# Altium project UAVCAN_rooms-Prj.PrjPcb
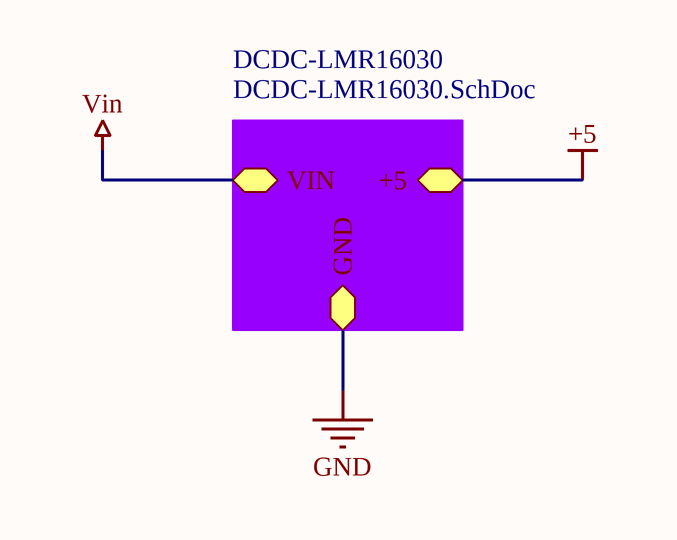
[diagram p0: UAVCAN_rooms-SchDoc.SchDoc]
Author: Ehsan Shaghaei; Version: 1.0
7 sheets, 92 parts. Net scope: hierarchical (ports join the sheet entries above them; power ports are global).
Board files: UAVCAN_rooms-PCBDoc.PcbDoc, DCDC-LMR16030-PCBDoc.PcbDoc
Sheets:
  UAVCAN_rooms-SchDoc.SchDoc
    DCDC-LMR16030 = DCDC-LMR16030.SchDoc
  ESP32_CAM.SchDoc
    DCDC-SPX3829m5 = DCDC-SPX3829m5.SchDoc
    DCDC-SPX3829m5 = DCDC-SPX3829m5.SchDoc
    DCDC-SPX3829m6 = DCDC-SPX3829m5.SchDoc
    CP2102_USB-UART = CP2102_USB-UART.SchDoc
    CAN_TJA1042-SchoDoc = CAN_TJA1042-SchoDoc.SchDoc
    DCDC-LMR16030 = DCDC-LMR16030.SchDoc
  PowerMonitor.SchDoc

## Sheet UAVCAN_rooms-SchDoc.SchDoc
size 431 x 279 mm; SheetNumber: 1; SheetTotal: 2

### Sub-sheets
DCDC-LMR16030 = DCDC-LMR16030.SchDoc: GND (bidir), VIN (bidir), +5 (bidir)

### Nets
Vin: sheet DCDC-LMR16030/VIN

### Notes on the sheet
- DWG. NO.
- REV.
- SHT.
- THIS DOCUMENT AND THE DATA DISCLOSED HEREIN OR HEREWITH IS THE PROPERTY OF ALTIUM LIMITED AND MAY BE FREELY DISTRIBUTED IN WHOLE. NO RIGHTS ARE RESERVED OR EXPRESS OR IMPLIED WARANTEE GIVEN.
- REVISION
- DESCRIPTION
- DATE
- APPROVED
- ENG:
- APPROVALS
- PROJECT
- DSN:
- CHK:
- REFERENCE DOCUMENTS
- PROJECT REVISION:
- TITLE
- DOCUMENT REVISION:
- DESIGN ITEM:
- BOM:
- FAB DWG:
- PCB DWG:
- ASSY DWG:
- SCALE:
- SIZE
- B
- CAGE CODE
- FILE NAME
- DWG NO.
- SHEET
- OF
- REV

## Sheet DCDC-LMR16030.SchDoc
size A3; Engineer: Ehsan Shaghaei; Revision: 9; SheetNumber: 3; SheetTotal: 7
Used 2 times, as channels DCDC-LMR16030, DCDC-LMR16030. Parts and nets are listed once, with the designators drawn on the sheet.
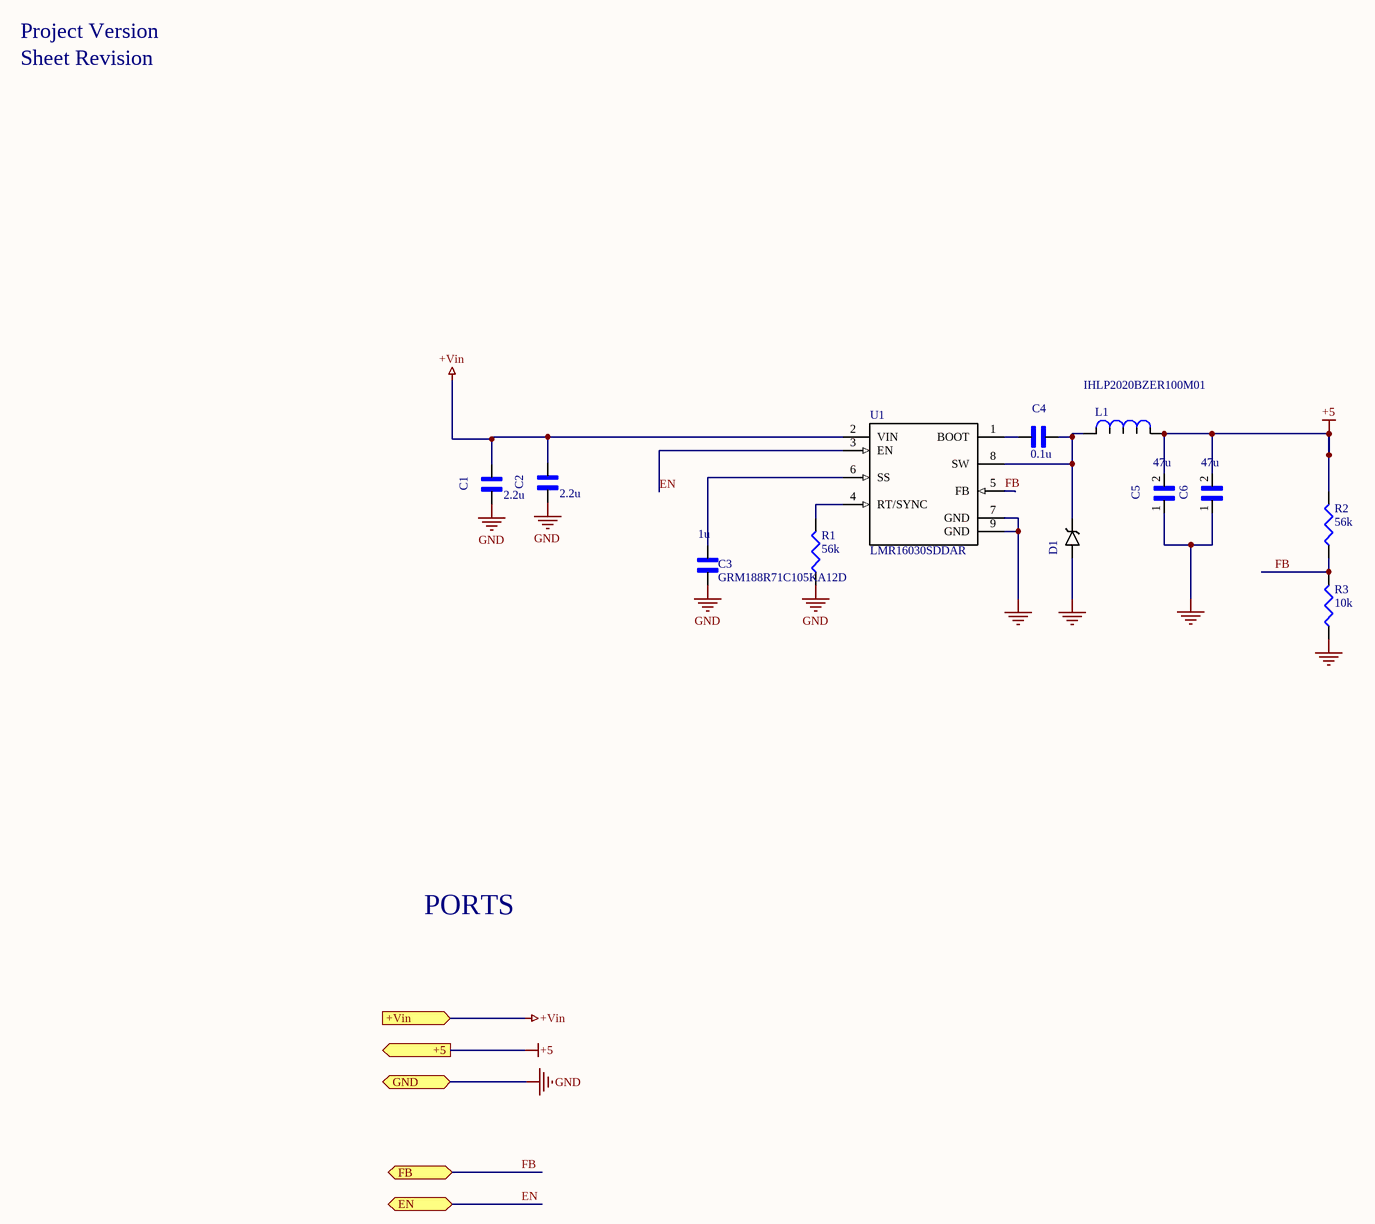
[diagram p1: DCDC-LMR16030.SchDoc]

### Parts
C1  value 2.2u  [*CAP3216X125N]  (hidden comment: GRM31CR71H225KA88L)
C2  value 2.2u  [*CAP3216X125N]  (hidden comment: GRM31CR71H225KA88L)
C3  GRM188R71C105KA12D  value 1u  [CAPC1608X90N]
C4  value 0.1u  [*CAPC1608X90]  (hidden comment: GX035C104MAT2-500)
C5  value 47u  [*CAPC3216X125N]  (hidden comment: GRM31CR61A476KE15L)
C6  value 47u  [*CAPC3216X125N]  (hidden comment: GRM31CR61A476KE15L)
D1  SK56  [*SMB_P6SMB62AT3G(Primary)]  (value not drawn)
L1  IHLP2020BZER100M01  [IHLP]
R1  value 56k  [J1-0603]  (hidden comment: Res3)
R2  value 56k  [J1-0603]  (hidden comment: Res3)
R3  value 10k  [J1-0603]  (hidden comment: RC0603FR-0710KL)
U1  LMR16030SDDAR  [*SOIC127P600X170-9N - duplicate]

### Ports
+5 (out), +Vin (in), EN (bidir), FB (bidir), GND (bidir)

### Nets
+5: C5.2 C6.2 L1.1 R2.2 ; port +5
+Vin: C1.1 C2.1 U1.2(VIN) ; port +Vin
GND: C1.2 C2.2 C3.1 C5.1 C6.1 D1.A R1.1 R3.1 U1.7(GND) U1.9(GND) ; port GND
EN: U1.3(EN) ; port EN
FB: R2.1 R3.2 U1.5(FB) ; port FB
NetC3_2: C3.2 U1.6(SS)
NetC4_1: C4.1 D1.C L1.2 U1.8(SW)
NetC4_2: C4.2 U1.1(BOOT)
NetR1_2: R1.2 U1.4(RT/SYNC)

### Channels
DCDC-LMR16030: ports +5=+5 +Vin=+Vin EN=EN_DCDC-LMR16030 FB=FB_DCDC-LMR16030 GND=GND
DCDC-LMR16030: designators end in _DCDC-LMR16030; ports +5=+5 +Vin=+Vin EN=EN_DCDC-LMR16030 FB=FB_DCDC-LMR16030 GND=GND

### Notes on the sheet
- Project Version
- Sheet Revision
- PORTS

### Library data of the parts
C1 C2 = GRM31CR71H225KA88L: 1206 2.2 uF 50 V В±10% Tolerance X7R SMT Multilayer Ceramic Capacitor; MF: Murata Electronics; Type: SMD; Package: 1206 Murata; SnapEDA_Link: https://www.snapeda.com/parts/GRM31CR71H225KA88L/Murata%20Electronics%20North%20America/view-part/?ref=snap; MP: GRM31CR71H225KA88L
C3 = GRM188R71C105KA12D: SMD Capacitor X7R(EIA) with Capacitance: 1.0uF Tol. 10%. Rated Voltage: 16Vdc; MF: Murata Electronics; Pacage Metric: 1608; MP: GRM188R71C105KA12D; SnapEDA_Link: https://www.snapeda.com/parts/GRM188R71C105KA12D/Murata%20Electronics%20North%20America/view-part/228340/?ref=snap; Package: 0603; ChipDip_Link: https://www.chipdip.ru/product/grm188r71c105ka12d; HelpURL: https://static.chipdip.ru/lib/428/DOC005428493.pdf; Type: SMD
C4 = GX035C104MAT2-500: Cap Thin Film 0.1uf 50v 0603; MF: AVX; MP: GX035C104MAT2-500 or CL10B104JB8NNNC; Pacage Metric: 1608; Type: SMD; Package: 0603 AVX; SnapEDA_Link: https://www.snapeda.com/parts/GX035C104MAT2-500/AVX/view-part/?ref=snap
C5 C6 = GRM31CR61A476KE15L: Multilayer Ceramic Capacitor, GRM Series, 47 - F, - 10%, X5R, 10 V, 1206 [3216 Metric]; MF: Murata Electronics; Type: SMD; Package: 1206 Murata Electronics; MP: GRM31CR61A476KE15L; SnapEDA_Link: https://www.snapeda.com/parts/GRM31CR61A476KE15L/Murata%20Electronics%20North%20America/view-part/?ref=snap
D1 = SK56: Диод Шоттки 5А 60В [SMB / DO-214AA]; MF: Littelfuse Inc.; Type: SMD; MP: SK56; Package: DO-214 Littelfuse; SnapEDA_Link: https://www.snapeda.com/parts/P6SMB62AT3G/Littelfuse%20Inc./view-part/?ref=snap; Value: *; ChipDip_Link: https://www.chipdip.ru/product/sk56
L1 = IHLP2020BZER100M01: 10ÂµH Shielded Molded Inductor 2.3A 199mOhm Max Nonstandard; MF: Vishay Dale; Type: SMD; SnapEDA_Link: https://www.snapeda.com/parts/IHLP2020BZER100M01/Vishay%20Dale/view-part/44808/?ref=snap; MP: IHLP2020BZER100M01; Value: *; Package: Nonstandard Vishay; HelpURL: http://www.vishay.com/docs/34253/ihlp-2020bz-01.pdf; ChipDip_Link: https://www.chipdip.ru/product/ihlp2020bzer100m11-inductor-ihlp-smd-2020-10
R1 R2 = Res3: Resistor; Pacage Metric: 1608; MP: RC0603FR-0756KL; ChipDip_Link: https://www.chipdip.ru/product0/9000079754; HelpURL: https://www.chipdip.ru/product0/9000079754; Package: R0603; Type: SMD
R3 = RC0603FR-0710KL: 10 kOhms 1 0.1 W 1 10 W Chip Resistor 0603 1608 Metric Thick Film; Pacage Metric: 1608; MF: Yageo or NXP; MP: 10K 1% 0603; ChipDip_Link: https://www.chipdip.ru/product0/9000079736; HelpURL: https://www.chipdip.ru/product0/9000079736; Package: R0603; Type: SMD; SnapEDA_Link: https://www.snapeda.com/parts/RC0603FR-0710KL/Yageo/view-part/?ref=dk&t=RC0603FR-0710KL&con_ref=None
U1 = LMR16030SDDAR: LMR16030SDDAR, Conv DC-DC 4.3V to 60V Step Down Single-Out 1V to 50V 3A Automotive 8-Pin HSOP EP T/R; MF: Texas Instruments; SnapEDA_Link: https://www.snapeda.com/parts/TPS54560DDA/Texas%20Instruments/view-part/?ref=snap; MP: LMR16030SDDAR; Package: PowerSOIC-8 Texas Instruments; Value: *; Type: SMD; ChipDip_Link: https://www.chipdip.ru/product1/8003448566; HelpURL: https://www.ti.com/lit/ds/symlink/lmr16030.pdf

## Sheet ESP32_CAM.SchDoc
size B; ApprovedBy: Kosnstantine; Engineer: Ehsan Shaghaei; SheetNumber: 2; SheetTotal: 7
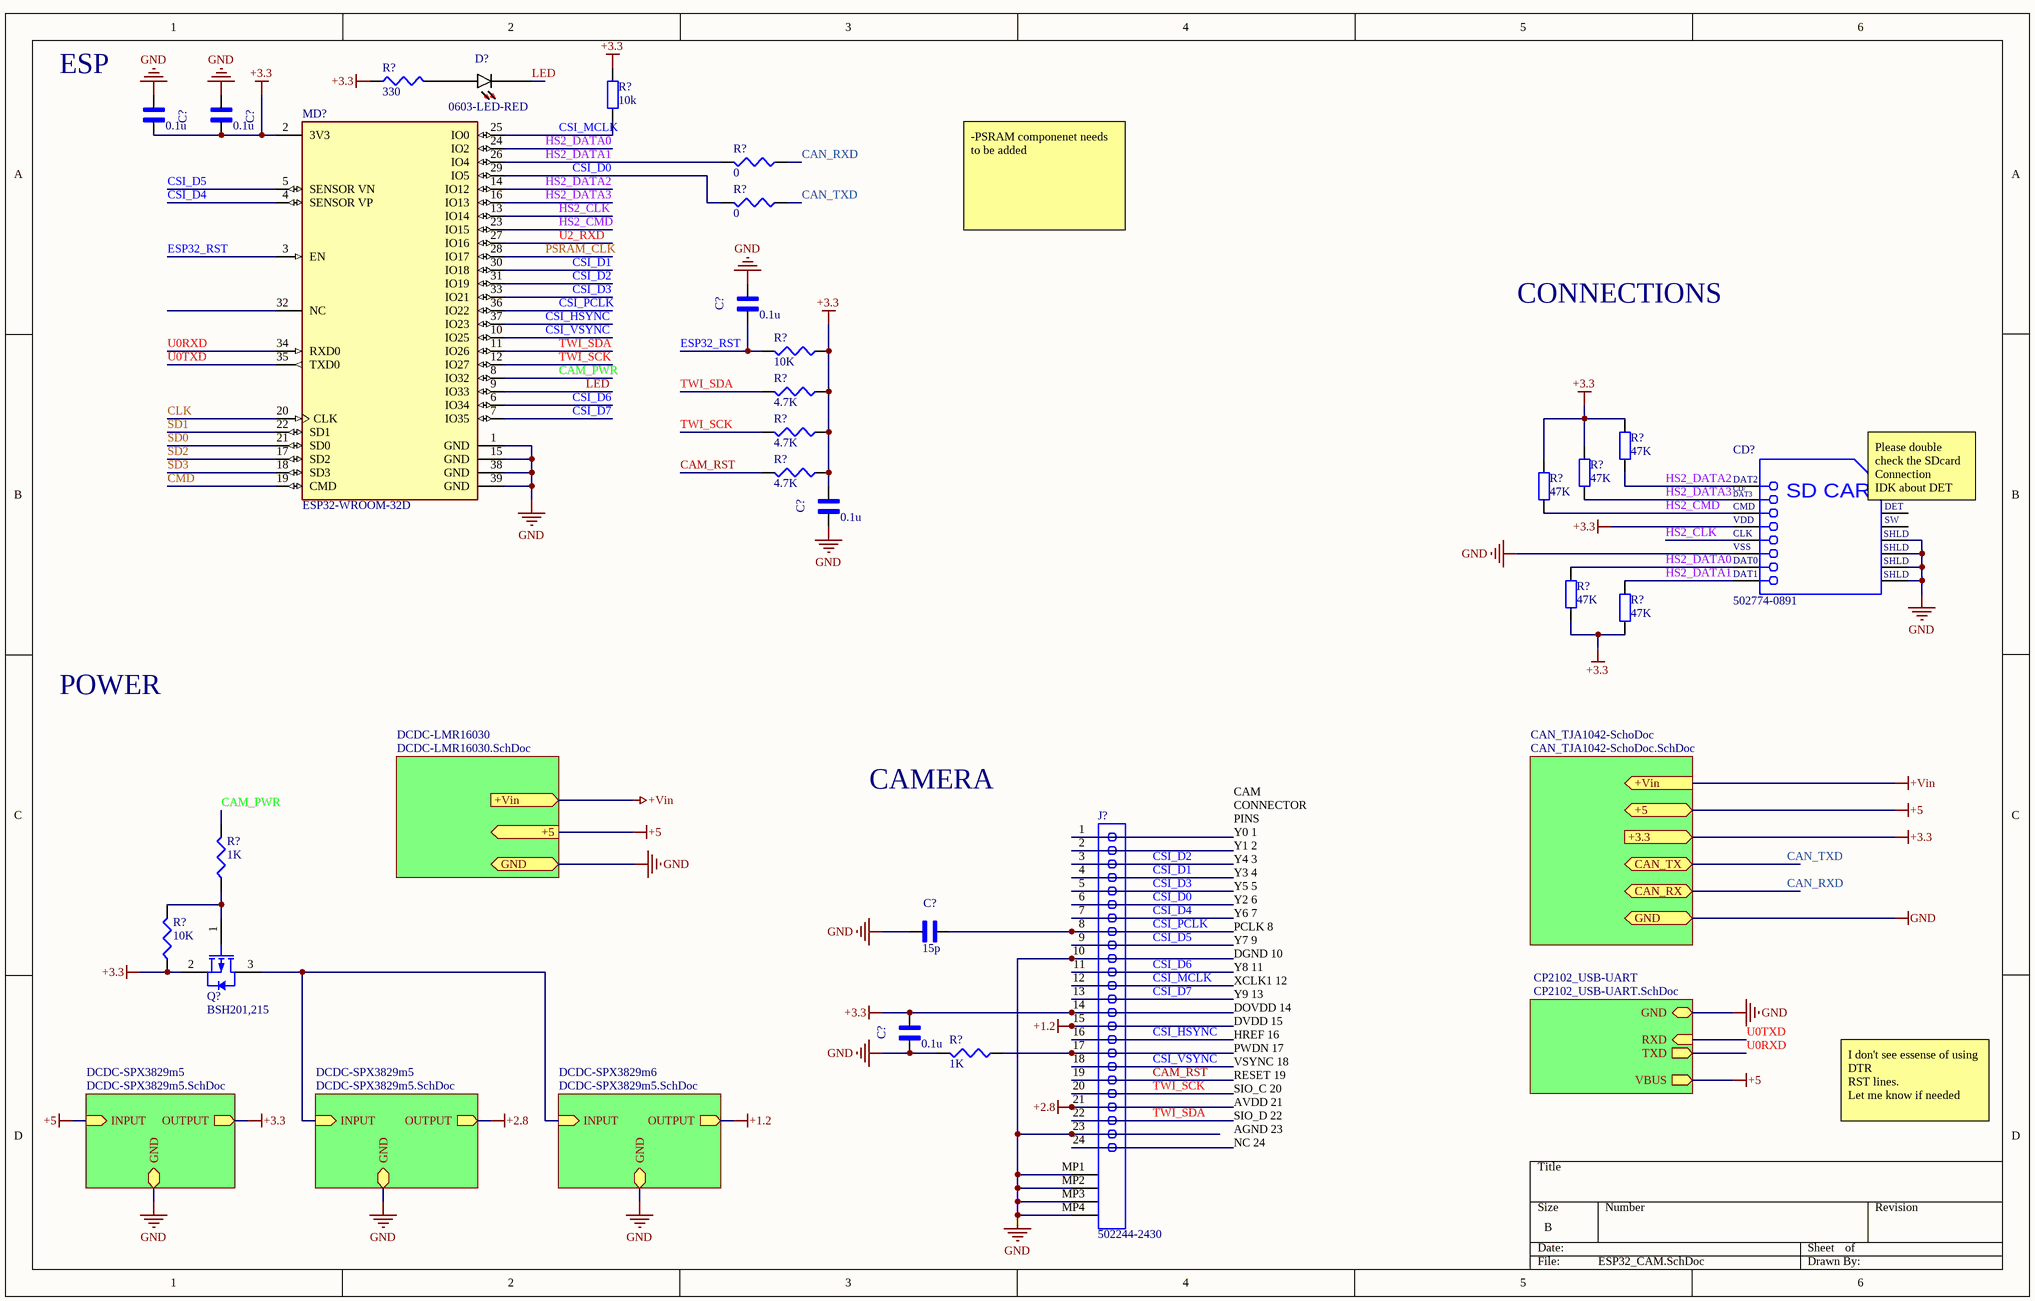
[diagram p2: ESP32_CAM.SchDoc]

### Parts
(Parts that share a designator on the sheet are numbered #1, #2 ... from top to bottom, then left to right.)
C?#1  value 0.1u  [*CAPC1608X90]  (hidden comment: GX035C104MAT2-500)
C?#2  value 0.1u  [*CAPC1608X90]  (hidden comment: GX035C104MAT2-500)
C?#3  value 0.1u  [*CAPC1608X90]  (hidden comment: GX035C104MAT2-500)
C?#4  value 0.1u  [*CAPC1608X90]  (hidden comment: GX035C104MAT2-500)
C?#5  value 15p  [*CAPC1608X90]  (hidden comment: GX035C104MAT2-500)
C?#6  value 0.1u  [*CAPC1608X90]  (hidden comment: GX035C104MAT2-500)
CD?  502774-0891  [MOLX-502774-0891_V]
D?#1  0603-LED-RED  [*LEDM1608X80_LTE-C1906R-14(Primary)]
J?#1  502244-2430  [MOLX-502244-2430]
MD?  ESP32-WROOM-32D  [FP-ESP32-WROOM-32D-MFG]
Q?  BSH201,215  [NXP-SOT23_M]
R?#1  value 330  [J1-0603]  (hidden comment: RC0603FR-07330RL)
R?#2  value 10k  [0603]  (hidden comment: Res2)
R?#3  value 0  [J1-0603]  (hidden comment: Res3)
R?#4  value 0  [J1-0603]  (hidden comment: Res3)
R?#5  value 10K  [J1-0603]  (hidden comment: Res3)
R?#6  value 4.7K  [J1-0603]  (hidden comment: Res3)
R?#7  value 4.7K  [J1-0603]  (hidden comment: Res3)
R?#8  value 47K  [0603]  (hidden comment: Res2)
R?#9  value 4.7K  [J1-0603]  (hidden comment: Res3)
R?#10  value 47K  [0603]  (hidden comment: Res2)
R?#11  value 47K  [0603]  (hidden comment: Res2)
R?#12  value 47K  [0603]  (hidden comment: Res2)
R?#13  value 47K  [0603]  (hidden comment: Res2)
R?#14  value 1K  [J1-0603]  (hidden comment: Res3)
R?#15  value 10K  [J1-0603]  (hidden comment: Res3)
R?#16  value 1K  [J1-0603]  (hidden comment: Res3)

### Sub-sheets
CAN_TJA1042-SchoDoc = CAN_TJA1042-SchoDoc.SchDoc: no entries
CP2102_USB-UART = CP2102_USB-UART.SchDoc: GND (bidir), VBUS (out), TXD (out), RXD (in)
DCDC-LMR16030 = DCDC-LMR16030.SchDoc: no entries
DCDC-SPX3829m5 = DCDC-SPX3829m5.SchDoc: GND (bidir), INPUT (in), OUTPUT (out)
DCDC-SPX3829m5 = DCDC-SPX3829m5.SchDoc: GND (bidir), INPUT (in), OUTPUT (out)
DCDC-SPX3829m6 = DCDC-SPX3829m5.SchDoc: GND (bidir), INPUT (in), OUTPUT (out)

### Ports
+3.3 (in), +5 (bidir), +5 (out), +Vin (in), +Vin (out), CAN_RX (bidir), CAN_TX (bidir), GND (bidir)

### Nets
+1.2: C?#1.1 C?#2.1 C?#4.1 C?#6.1 CD?.4(VDD) J?#1.14 J?#1.15 J?#1.21 MD?.2(3V3) Q?.2(S) R?#1.1 R?#2.2 R?#5.1 R?#6.1 R?#7.1 R?#8.2 R?#9.1 R?#10.2 R?#11.2 R?#12.2 R?#13.2 R?#15.1 ; port +3.3, sheet DCDC-SPX3829m5/OUTPUT, sheet DCDC-SPX3829m5/OUTPUT, sheet DCDC-SPX3829m6/OUTPUT  [also labelled +2.8, +3.3]
+5: Q?.3(D) ; port +5, sheet DCDC-SPX3829m5/INPUT, sheet DCDC-SPX3829m5/INPUT, sheet DCDC-SPX3829m6/INPUT, sheet CP2102_USB-UART/VBUS
GND: C?#1.2 C?#2.2 C?#3.1 C?#4.2 C?#5.2 C?#6.2 CD?.6(VSS) CD?.11(SHLD) CD?.12(SHLD) CD?.13(SHLD) CD?.14(SHLD) J?#1.10 J?#1.23 J?#1.MP1 J?#1.MP2 J?#1.MP3 J?#1.MP4 MD?.1(GND) MD?.15(GND) MD?.38(GND) MD?.39(GND) R?#16.2 ; port GND, sheet DCDC-SPX3829m5/GND, sheet DCDC-SPX3829m5/GND, sheet DCDC-SPX3829m6/GND, sheet CP2102_USB-UART/GND
CAM_PWR: MD?.8(IO32) R?#14.2
CAM_RST: J?#1.19 R?#9.2
CAN_RXD: R?#3.1 ; port CAN_RX
CAN_TXD: R?#4.1 ; port CAN_TX
CLK: MD?.20(CLK)
CMD: MD?.19(CMD)
CSI_D0: J?#1.6 MD?.29(IO5) R?#4.2
CSI_D1: J?#1.4 MD?.30(IO18)
CSI_D2: J?#1.3 MD?.31(IO19)
CSI_D3: J?#1.5 MD?.33(IO21)
CSI_D4: J?#1.7 MD?.4(SENSOR_VP)
CSI_D5: J?#1.9 MD?.5(SENSOR_VN)
CSI_D6: J?#1.11 MD?.6(IO34)
CSI_D7: J?#1.13 MD?.7(IO35)
CSI_HSYNC: J?#1.16 MD?.37(IO23)
CSI_MCLK: J?#1.12 MD?.25(IO0) R?#2.1
CSI_PCLK: C?#5.1 J?#1.8 MD?.36(IO22)
CSI_VSYNC: J?#1.18 MD?.10(IO25)
ESP32_RST: C?#3.2 MD?.3(EN) R?#5.2
HS2_CLK: CD?.5(CLK) MD?.13(IO14)
HS2_CMD: CD?.3(CMD) MD?.23(IO15) R?#11.1
HS2_DATA0: CD?.7(DAT0) MD?.24(IO2) R?#12.1
HS2_DATA1: CD?.8(DAT1) MD?.26(IO4) R?#3.2 R?#13.1
HS2_DATA2: CD?.1(DAT2) MD?.14(IO12) R?#8.1
HS2_DATA3: CD?.2(CD/DAT3) MD?.16(IO13) R?#10.1
LED: D?#1.C MD?.9(IO33)
PSRAM_CLK: MD?.28(IO17)
SD0: MD?.21(SD0)
SD1: MD?.22(SD1)
SD2: MD?.17(SD2)
SD3: MD?.18(SD3)
TWI_SCK: J?#1.20 MD?.12(IO27) R?#7.2
TWI_SDA: J?#1.22 MD?.11(IO26) R?#6.2
U0RXD: MD?.34(RXD0) ; sheet CP2102_USB-UART/TXD  [project net TXD1]
U0TXD: MD?.35(TXD0) ; sheet CP2102_USB-UART/RXD  [project net RXD1]
U2_RXD: MD?.27(IO16)
NetD?#1_A: D?#1.A R?#1.2
NetJ?#1_17: J?#1.17 R?#16.1
NetQ?_1: Q?.1(G) R?#14.1 R?#15.2

Not connected (* = marked no-connect by the designer): CD? 9(DETECT) 10(SWITCH); J?#1 1 2 24; MD? 32(NC)

### Notes on the sheet
- ESP
- -PSRAM componenet needs to be added
- CONNECTIONS
- (near CD?) Please double check the SDcard Connection
  IDK about DET and SW
- POWER
- CAMERA
- I don't see essense of using
  DTR
  RST lines.
  Let me know if needed
- CAM CONNECTOR PINS
  Y0 1
  Y1 2
  Y4 3
  Y3 4
  Y5 5
  Y2 6
  Y6 7
  PCLK 8
  Y7 9
  DGND 10
  Y8 11
  XCLK1 12
  Y9 13
  DOVDD 14
  DVDD 15
  HREF 16
  PWDN 17
  VSYNC 18
  RESET 19
  SIO_C 20
  AVDD 21
  SIO_D 22
  AGND 23
  NC 24
- (in symbol CMP-2000-05248-1) CD/; DAT3; SD CARD; DET; SW

### Library data of the parts
C?#1-C?#6 = GX035C104MAT2-500: as C4 on sheet DCDC-LMR16030; Package: 0603 AVX; SnapEDA_Link: https://www.snapeda.com/parts/GX035C104MAT2-500/AVX/view-part/?ref=snap
CD? = CMP-2000-05248-1: Micro SD Memory Card Connector, 0.5 A, 10 V (DC), -25 to 85 degC, 8-Pin SMT, RoHS, Tape and Reel; Manufacturer: Molex; 3D Model: 502774-0891.stp; Online Catalog: microSD™Series; Number of Positions: 10(8+2); Card Type: SecureDigital-microSD™; Insertion, Removal Method: PushIn,PushOut; Other Names: WM24066DKR; Connector Type: ConnectorandEjector; Value: 1n; Features: Switch; Family: MemoryConnectors-PCCardSockets; Manufacturer URL: http://www.molex.com/; Mounting Type: SurfaceMount,RightAngle; Contact Finish Thickness: 20µin(0.51µm); Standard Package: 1; Series: 502774; Ejector Side: -; Datasheet Version: Rev. D, 04/2004; Category: Connectors,Interconnects; Contact Finish: Gold; Datasheet URL: https://datasheet.ciiva.com/1104/1499551-1104671.pdf; RoHS Information: 502774-0891CertofCompliance; Mounting Feature: Reverse-Bottom; Packaging: Digi-Reel; Height Above Board: 0.071"(1.80mm); Catalog Drawings: 502774-0891
D?#1 = 0603-LED-RED: Red 620nm LED Indication - Discrete 2.2V 0603 (1608 Metric); MP: LTST-C194KRKT or SML-D12U1WT86; Type: SMD; Package: 0603 Lite-On; SnapEDA_Link: https://www.snapeda.com/parts/LTE-C1906R-14/Lite-On%20Inc./view-part/?ref=snap; Value: *
J?#1 = CMP-1243-00005-1: 0.5 mm Pitch Easy-On(TM) Type FFC Connector, for LVDS, 2.33 mm Mated Height, Right Angle, ZIF, SMT, Bottom Contact, 24 Circuits, -25 to 85 degC, ELV and RoHS Compliant, Tape and Reel; Manufacturer: Molex; Circuits (Loaded): 24; Material - Plating Mating: Gold; Entry Angle: 90degrees Angle; Pitch - Mating Interface: 0.50mm; PCB Locator: No; Material - Metal: Phosphor Bronze; PCB Retention: Yes; Current (Max per Contact): 0.4A; Mated Height: 2.33mm; Durability (mating cycles max): 20; Voltage (Max): 50V AC (RMS)/DC; Contact Position: Bottom; ComponentLink1Description: Manufacturer URL; Mounting Technology: Surface Mount; PackageDescription: 24-Lead FFC Connector, Pitch 0.5 mm; ComponentLink3URL: http://www.molex.com/pdm_docs/sd/5022442430_sd.pdf; ComponentLink2URL: http://www.molex.com/webdocs/datasheets/pdf/en-us/5022442430_FFC_FPC_CONNECTORS.pdf; Packing: Tape and Reel; ComponentLink3Description: Package Specification; PackageVersion: Rev. C, 03/2010; PartNumber: 502244-2430; Number of Rows: 1; PackageReference: 502244-2430; RoHS: TRUE; Stackable: No; ComponentLink2Description: Datasheet; ComponentLink1URL: http://www.molex.com/molex/index.jsp; Polarized to PCB: Yes; Material - Plating Termination: Gold; Orientation: Right Angle
MD? = CMP-194065-000003-1: WIFI MODULE 32MBITS SPI FLASH; Manufacturer: Espressif Systems; Max Supply Voltage: 3.6V; Nominal Supply Current: 500mA; Max Frequency: 2484MHz; Number Of Adc Channels: 16; Number Of Gpio: 32; Interface: I2C,SPI,UART,Ethernet,I2S,Other; Data Rate: 150Mbits/s; Min Supply Voltage: 3V; Bandwidth: 72MHz; Sensitivity: -98dBm; Octopart: https://octopart.com/esp32-wroom-32d-espressif+systems-91040050; Package: ESP32-WROOM-32D; ComponentLink2URL: https://www.espressif.com/sites/default/files/documentation/esp32-wroom-32d_esp32-wroom-32u_datasheet_en.pdf; Lead Free: Yes; Category: UNK; Mouser Description: Wi-Fi/BT BLE Module ESP32-D0WD, SPI Flash, UART, P; Device Class L1: Integrated Circuits (ICs); RoHS: TRUE; Temperature Range Low: -40°C; ComponentLink2Description: Datasheet; Digikey Description: WIFI MODULE 32MBITS SPI FLASH; Height: 3.2mm; Temperature: -40°C to +85°C; Manufacturer Part Number: ESP32-WROOM-32D; Device Class L3: Transceivers; Device Class L2: RF Semiconductors and Devices; Temperature Range High: +85°C; Automotive: No
Q? = CMP-1258-00153-1: P-Channel Enhancement Mode MOS Transistor, -60 V, -0.3 A, -55 to 150 degC, 3-Pin SOT23, Tape and Reel; Manufacturer: NXP Semiconductors; Ciss [typ] (pF): 70; Qr [typ] (nC): 58; VGSth [typ] (V): -1.9; Channel Type: P; Coss [typ] (pF): 15; Packing: Tape & Reel; PackageReference: SOT23; Code_JEDEC: TO-236AB; PartNumber: BSH201,215; ID [max] (A): -0.3; ComponentLink1URL: http://www.nxp.com/; PackageDescription: 3-Pin Small Outline Transistor Package, Body 2.9 x 1.3 mm, Pitch 0.95 mm; PackageVersion: 06-03-16, 03/2006; DatasheetVersion: Rev. 1.000; ComponentLink2URL: http://www.nxp.com/documents/data_sheet/BSH201.pdf; Mounting Technology: Surface Mount; ComponentLink1Description: Manufacturer URL; ComponentLink2Description: Datasheet; ComponentLink3Description: Package Specification; ComponentLink3URL: http://www.nxp.com/documents/outline_drawing/sot023_po.pdf; VDS [max] (V): -60
R?#1 = RC0603FR-07330RL: 330 Ohms ±1% 0.1W, 1/10W Chip Resistor 0603 (1608 Metric) Thick Film; Pacage Metric: 1608; MF: Yageo or NXP; ChipDip_Link: https://www.chipdip.ru/product0/9000079628; HelpURL: https://www.chipdip.ru/product0/9000079628; Package: R0603; Type: SMD; MP: RC0603FR-07330RL; SnapEDA_Link: https://www.snapeda.com/parts/RC0603FR-07330RL/Yageo/view-part/?ref=search&t=RC0603FR-07330RL
R?#2 R?#8 R?#10-R?#13 = Res2: Resistor; Published: 8-Jun-2000; LatestRevisionDate: 17-Jul-2002; LatestRevisionNote: Re-released for DXP Platform.; PackageReference: AXIAL-0.4; Publisher: Altium Limited
R?#3-R?#7 R?#9 R?#14-R?#16 = Res3: as R1 on sheet DCDC-LMR16030; ChipDip_Link: https://www.chipdip.ru/product0/9000079754; HelpURL: https://www.chipdip.ru/product0/9000079754; Package: R0603; Type: SMD

## Sheet DCDC-SPX3829m5.SchDoc
size Letter; SheetNumber: 4; SheetTotal: 7
Used 3 times, as channels DCDC-SPX3829m5, DCDC-SPX3829m5, DCDC-SPX3829m6. Parts and nets are listed once, with the designators drawn on the sheet.
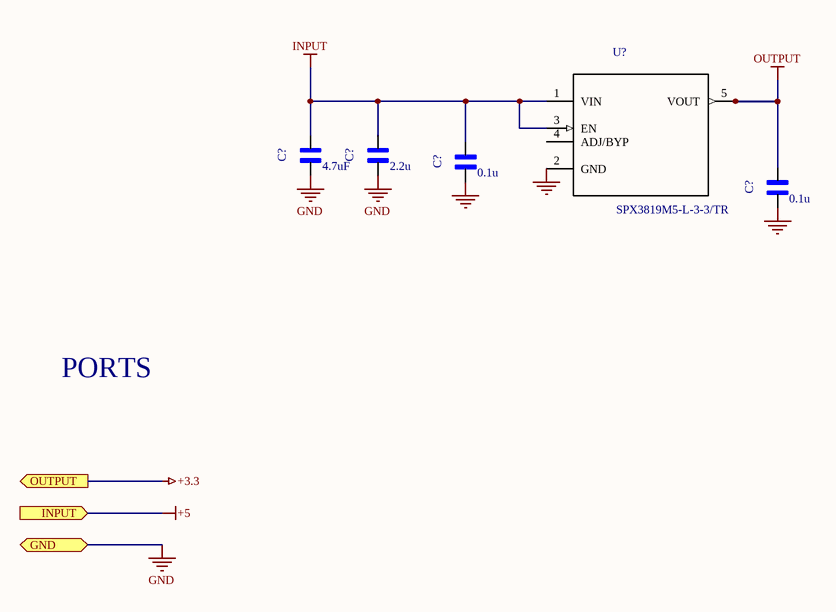
[diagram p3: DCDC-SPX3829m5.SchDoc]

### Parts
(Parts that share a designator on the sheet are numbered #1, #2 ... from top to bottom, then left to right.)
C?#1  value 4.7uF  [*CAP3216X125N]  (hidden comment: GRM31CR71H225KA88L)
C?#2  value 2.2u  [*CAP3216X125N]  (hidden comment: GRM31CR71H225KA88L)
C?#3  value 0.1u  [*CAPC1608X90]  (hidden comment: GX035C104MAT2-500)
C?#4  value 0.1u  [*CAPC1608X90]  (hidden comment: GX035C104MAT2-500)
U?  SPX3819M5-L-3-3/TR  [*SOT95P280X145-5N]

### Ports
GND (bidir), INPUT (in), OUTPUT (out)

### Nets
+3.3: port OUTPUT
+5: port INPUT
GND: C?#1.2 C?#2.2 C?#3.2 C?#4.2 U?.2(GND) ; port GND
INPUT: C?#1.1 C?#2.1 C?#3.1 U?.1(VIN) U?.3(EN)
OUTPUT: C?#4.1 U?.5(VOUT)

Not connected (* = marked no-connect by the designer): U? 4(ADJ/BYP)

### Channels
DCDC-SPX3829m5: designators C?=C?_DCDC-SPX3829m5#3 C?=C?_DCDC-SPX3829m5#4 C?=C?_DCDC-SPX3829m5#2 C?=C?_DCDC-SPX3829m5#1 U?=U?_DCDC-SPX3829m5#1; ports GND=GND INPUT=+5 OUTPUT=+1.2
DCDC-SPX3829m5: designators C?=C?_DCDC-SPX3829m5#7 C?=C?_DCDC-SPX3829m5#8 C?=C?_DCDC-SPX3829m5#6 C?=C?_DCDC-SPX3829m5#5 U?=U?_DCDC-SPX3829m5#2; ports GND=GND INPUT=+5 OUTPUT=+1.2
DCDC-SPX3829m6: designators C?=C?_DCDC-SPX3829m6#3 C?=C?_DCDC-SPX3829m6#4 C?=C?_DCDC-SPX3829m6#2 C?=C?_DCDC-SPX3829m6#1 U?=U?_DCDC-SPX3829m6; ports GND=GND INPUT=+5 OUTPUT=+1.2

### Notes on the sheet
- PORTS

### Library data of the parts
C?#1 C?#2 = GRM31CR71H225KA88L: as C1 on sheet DCDC-LMR16030; Package: 1206 Murata; SnapEDA_Link: https://www.snapeda.com/parts/GRM31CR71H225KA88L/Murata%20Electronics%20North%20America/view-part/?ref=snap; MP: GRM31CR71H225KA88L
C?#3 C?#4 = GX035C104MAT2-500: Cap Thin Film 0.1uf 50v 0603; MF: AVX; Pacage Metric: 1608; Type: SMD; Package: 0603 AVX; MP: GX035C104MAT2-500; SnapEDA_Link: https://www.snapeda.com/parts/GX035C104MAT2-500/AVX/view-part/?ref=snap
U? = SPX3819M5-L: Low Dropout Voltage Regulator, Adjustable 0.5A, В±1%, 2.5 to 16 Vin, 5-Pin SOT-23; MF: MaxLinear, Inc.; Value: 3V3; MP: SPX3819M5-L-3-3/TR; Package: SOT-23-5 Exar; SnapEDA_Link: https://www.snapeda.com/parts/SPX3819M5-L/MaxLinear%2C%20Inc./view-part/?ref=snap; Type: SMD; ChipDip_Link: https://www.chipdip.ru/product1/8003455237; HelpURL: http://www.farnell.com/datasheets/2614478.pdf

## Sheet CP2102_USB-UART.SchDoc
size B; SheetNumber: 5; SheetTotal: 7
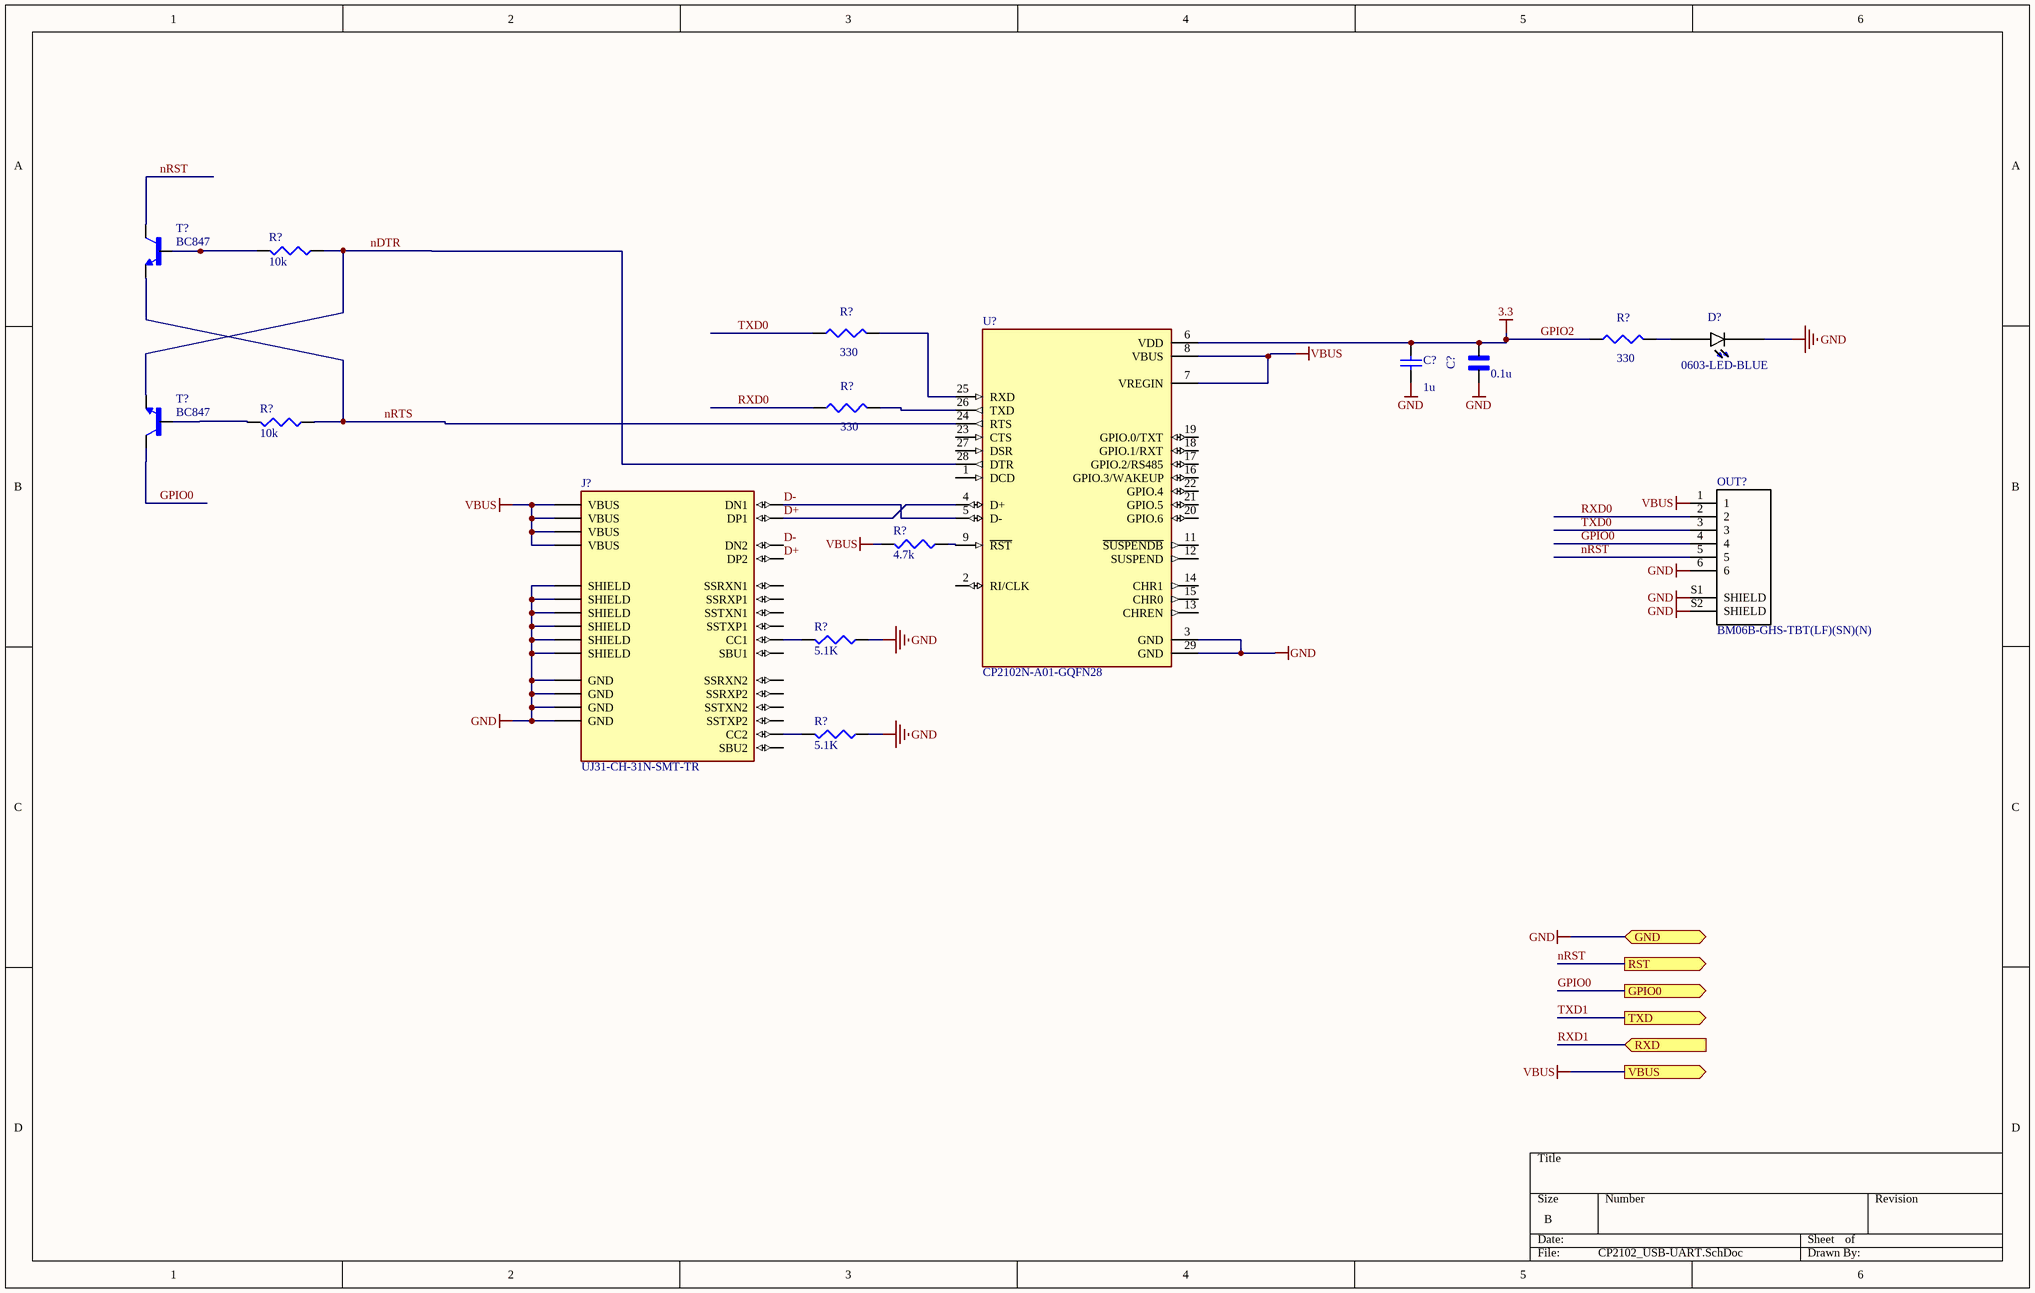
[diagram p4: CP2102_USB-UART.SchDoc]

### Parts
(Parts that share a designator on the sheet are numbered #1, #2 ... from top to bottom, then left to right.)
C?#7  value 1u  [1608[0603]]  (hidden comment: Cap Semi)
C?#8  value 0.1u  [*CAPC1608X90]  (hidden comment: GX035C104MAT2-500)
D?#2  0603-LED-BLUE  [*LEDM1608X80_LTE-C1906R-14(Primary)]
J?#2  UJ31-CH-31N-SMT-TR  [CUI_UJ31-CH-31N-SMT-TR]
OUT?  BM06B-GHS-TBT(LF)(SN)(N)  [*JST_BM06B-GHS-TBT(LF)(SN)(N)_BM06B-GHS-TBT(LF)(SN)(N)(Primary)]
R?#17  value 10k  [J1-0603]  (hidden comment: Res3)
R?#18  value 330  [J1-0603]  (hidden comment: Res3)
R?#19  value 330  [J1-0603]  (hidden comment: Res3)
R?#20  value 330  [J1-0603]  (hidden comment: Res3)
R?#21  value 10k  [J1-0603]  (hidden comment: Res3)
R?#22  value 4.7k  [J1-0603]  (hidden comment: Res3)
R?#23  value 5.1K  [J1-0603]  (hidden comment: Res3)
R?#24  value 5.1K  [J1-0603]  (hidden comment: Res3)
T?#1  BC847  [SOT23]
T?#2  BC847  [SOT23]
U?#1  CP2102N-A01-GQFN28  [QFN50P500X500X80-29N]

### Ports
GND (bidir), GPIO0 (out), RST (out), RXD (in), TXD (out), VBUS (out)

### Nets
GND: C?#7.2 C?#8.2 D?#2.C J?#2.A1(GND) J?#2.A12(GND) J?#2.B1(GND) J?#2.B12(GND) J?#2.SH1(SHIELD) J?#2.SH2(SHIELD) J?#2.SH3(SHIELD) J?#2.SH4(SHIELD) J?#2.SH5(SHIELD) J?#2.SH6(SHIELD) OUT?.6 OUT?.S1(SHIELD) OUT?.S2(SHIELD) R?#23.1 R?#24.1 U?#1.3(GND) U?#1.29(GND) ; port GND
GPIO2: C?#7.1 C?#8.1 R?#19.1 U?#1.6(VDD)  [also labelled 3.3]
VBUS: J?#2.A4(VBUS) J?#2.A9(VBUS) J?#2.B4(VBUS) J?#2.B9(VBUS) OUT?.1 R?#22.2 U?#1.7(VREGIN) U?#1.8(VBUS) ; port VBUS  [project net +5]
D+: J?#2.A6(DP1) J?#2.B6(DP2) U?#1.4(D+)
D-: J?#2.A7(DN1) J?#2.B7(DN2) U?#1.5(D-)
GPIO0: OUT?.4 T?#2.3(C) ; port GPIO0
nDTR: R?#17.1 T?#2.2(E) U?#1.28(DTR)
nRST: OUT?.5 T?#1.3(C) ; port RST
nRTS: R?#21.1 T?#1.2(E) U?#1.24(RTS)
RXD0: OUT?.2 R?#20.1
TXD0: OUT?.3 R?#18.1
NetD?#2_A: D?#2.A R?#19.2
NetJ?#2_A5: J?#2.A5(CC1) R?#23.2
NetJ?#2_B5: J?#2.B5(CC2) R?#24.2
NetR?#17_2: R?#17.2 T?#1.1(B)
NetR?#18_2: R?#18.2 U?#1.25(RXD)
NetR?#20_2: R?#20.2 U?#1.26(TXD)
NetR?#21_2: R?#21.2 T?#2.1(B)
NetR?#22_1: R?#22.1 U?#1.9(~{RST})

Not connected (* = marked no-connect by the designer): J?#2 A2(SSTXP1) A3(SSTXN1) A8(SBU1) A10(SSRXN2) A11(SSRXP2) B2(SSTXP2) B3(SSTXN2) B8(SBU2) B10(SSRXN1) B11(SSRXP1); U?#1 1(DCD) 2(RI/CLK) 11(~{SUSPENDB}) 12(SUSPEND) 13(CHREN) 14(CHR1) 15(CHR0) 16(GPIO.3/WAKEUP) 17(GPIO.2/RS485) 18(GPIO.1/RXT) 19(GPIO.0/TXT) 20(GPIO.6) 21(GPIO.5) 22(GPIO.4) 23(CTS) 27(DSR)

### Library data of the parts
C?#7 = Cap Semi: Capacitor (Semiconductor SIM Model); Published: 8-Jun-2000; LatestRevisionDate: 29-May-2009; LatestRevisionNote: IPC-7351 Footprint Added.; PackageReference: C1206; Publisher: Altium Limited; PackageDescription: Chip Capacitor
C?#8 = GX035C104MAT2-500: as C4 on sheet DCDC-LMR16030; Package: 0603 AVX; SnapEDA_Link: https://www.snapeda.com/parts/GX035C104MAT2-500/AVX/view-part/?ref=snap
D?#2 = LTE-C1906R-14: LED IrLED Chip LED 2-Pin SMD T/R; Package: 0603 Lite-On; MP: 0603-LED-BLUE; SnapEDA_Link: https://www.snapeda.com/parts/LTE-C1906R-14/Lite-On%20Inc./view-part/?ref=snap; Value: *; Type: SMD
J?#2 = UJ31-CH-31N-SMT-TR: Type C, USB 3.1 Gen 2, 5 A, Right Angle, Surface Mount _SMT_, USB Receptacle; MF: CUI Devices; Value: *; SnapEDA_Link: https://www.snapeda.com/parts/UJ31-CH-31N-SMT-TR/CUI%20Devices/view-part/2776725/?ref=snap; Availability: Unavailable; Price: None; Package: None; MP: UJ31-CH-31N-SMT-TR; ChipDip_Link: https://www.chipdip.ru/product1/8002862225; HelpURL: https://www.chipdip.ru/product1/8002862225
OUT? = BM06B-GHS-TBT(LF)(SN)(N): Conn Header Gh Top 6pos 1.25mm; MP: BM06B-GHS-TBT_LF__SN__N_; MF: JST Sales; Package: None; Availability: Unavailable; SnapEDA_Link: https://www.snapeda.com/parts/BM06B-GHS-TBT%28LF%29%28SN%29%28N%29/JST%20Sales%20America%20Inc./view-part/?ref=snap; Price: None; Value: *
R?#17 R?#21 = Res3: Resistor; Pacage Metric: 1608; MP: 10K 1% 0603; ChipDip_Link: https://www.chipdip.ru/product0/9000079736; HelpURL: https://www.chipdip.ru/product0/9000079736; Package: R0603; Type: SMD
R?#18-R?#20 = Res3: Resistor; Pacage Metric: 1608; MP: RC0603FR-07330RL; ChipDip_Link: https://www.chipdip.ru/product0/9000079628; HelpURL: https://www.chipdip.ru/product0/9000079628; Package: R0603; Type: SMD
R?#22-R?#24 = Res3: Resistor; Pacage Metric: 1608; MP: 4.7K 1% 0603; ChipDip_Link: https://www.chipdip.ru/product0/9000079736; HelpURL: https://www.chipdip.ru/product0/9000079736; Package: R0603; Type: SMD
T?#1 T?#2 = BC847: <b>NPN TRANSISTOR</b>; MF: {'manufacturer': u'Rectron'}; Package: None; MP: BC847; Value: *; Availability: Unavailable; Price: None
U?#1 = CP2102N-A01-GQFN28: Ic Bridge Usb To Uart 28qfn; MF: {'manufacturer': u'Silicon Labs'}; MP: CP2102N-A01-GQFN28; Value: *; Package: None; Price: None; Availability: Unavailable

## Sheet CAN_TJA1042-SchoDoc.SchDoc
size B; SheetNumber: 6; SheetTotal: 7
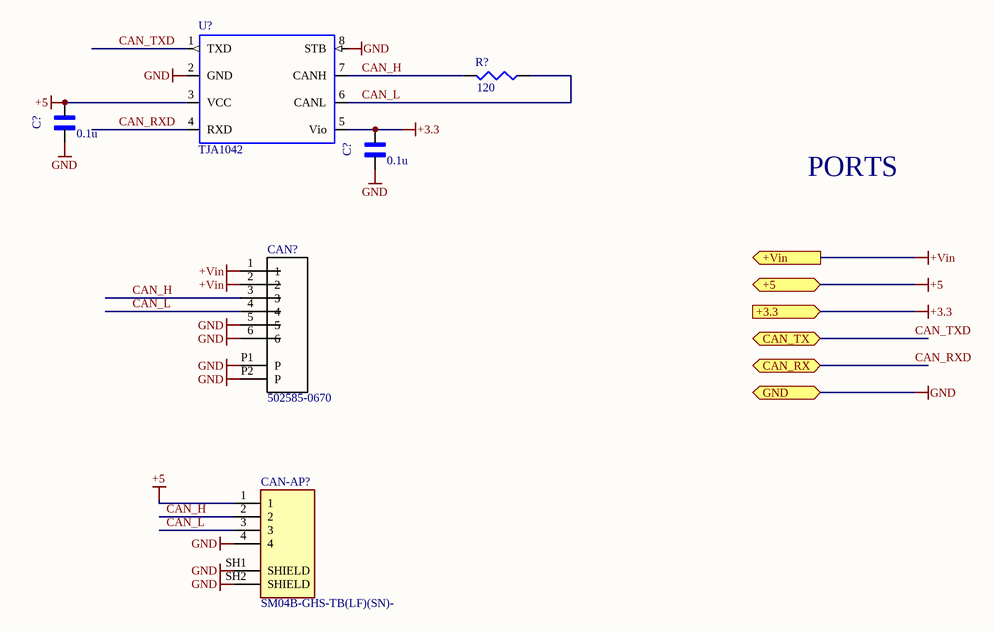
[diagram p5: CAN_TJA1042-SchoDoc.SchDoc]

### Parts
(Parts that share a designator on the sheet are numbered #1, #2 ... from top to bottom, then left to right.)
C?#9  value 0.1u  [*CAPC1608X90]  (hidden comment: GX035C104MAT2-500)
C?#10  value 0.1u  [*CAPC1608X90]  (hidden comment: GX035C104MAT2-500)
CAN-AP?  SM04B-GHS-TB(LF)(SN)-  [JST_SM04B-GHS-TB(LF)(SN)-]
CAN?  502585-0670  [MOLEX_502585-0670]
R?#25  value 120  [J1-0603]  (hidden comment: Res3)
U?#2  TJA1042  [SOT782-1]

### Ports
+3.3 (in), +5 (bidir), +Vin (out), CAN_RX (bidir), CAN_TX (bidir), GND (bidir)

### Nets
+3.3: C?#10.1 U?#2.5(Vio) ; port +3.3  [project net +1.2]
+5: C?#9.1 CAN-AP?.1 U?#2.3(VCC) ; port +5
+Vin: CAN?.1 CAN?.2 ; port +Vin
GND: C?#9.2 C?#10.2 CAN-AP?.4 CAN-AP?.SH1(SHIELD) CAN-AP?.SH2(SHIELD) CAN?.5 CAN?.6 CAN?.P1(P) CAN?.P2(P) U?#2.2(GND) U?#2.8(STB) ; port GND
CAN_H: CAN-AP?.2 CAN?.3 R?#25.2 U?#2.7(CANH)
CAN_L: CAN-AP?.3 CAN?.4 R?#25.1 U?#2.6(CANL)
CAN_RXD: U?#2.4(RXD) ; port CAN_RX
CAN_TXD: U?#2.1(TXD) ; port CAN_TX

### Notes on the sheet
- PORTS

### Library data of the parts
C?#9 C?#10 = GX035C104MAT2-500: as C4 on sheet DCDC-LMR16030; Package: 0603 AVX; SnapEDA_Link: https://www.snapeda.com/parts/GX035C104MAT2-500/AVX/view-part/?ref=snap
CAN-AP? = SM04B-GHS-TB(LF)(SN)-: Connector Header Surface Mount, Right Angle 4 position 0.049 _1.25mm_; MF: JST Sales; MP: SM04B-GHS-TB(LF)(SN); Package: None; Value: *; SnapEDA_Link: https://www.snapeda.com/parts/SM04B-GHS-TB%28LF%29%28SN%29-/JST%20Sales%20America%20Inc./view-part/2759740/?ref=snap; HelpURL: http://www.farnell.com/datasheets/2082975.pdf; System: Connector; ChipDip_Link: https://www.chipdip.ru/product/sm04b-ghs-tb-lf-sn-gh-1.25mm-header-side-ent
CAN? = 502585-0670: 1.50mm Pitch, CLIK-Mate PCB Receptacle, Single Row, Surface Mount, Right-Angle, Tin Plating, Positive Lock, 6 Circuits, Natural; MF: Molex; System: Connector; MP: 502585-0670; Package: None; SnapEDA_Link: https://www.snapeda.com/parts/502494-0670/Molex/view-part/?ref=snap; Value: *; Type: SMD
R?#25 = Res3: 120 Ohms 1 0.1 W 1 10 W Chip Resistor 0603 1608 Metric Thick Film; Pacage Metric: 1608; MP: RC0603FR-07120RL; ChipDip_Link: https://www.chipdip.ru/product0/9000079618; HelpURL: https://www.chipdip.ru/product0/9000079618; Package: R0603; Type: SMD
U?#2 = TJA1042: 1/1 Transceiver Half CANbus 8-SO; MF: NXP USA; SnapEDA_Link: https://www.snapeda.com/parts/TJA1042/NXP%20USA%20Inc./view-part/900919/?ref=snap; Value: *; MP: TJA1042; Package: VDFN-8 NXP USA; ChipDip_Link: https://www.chipdip.ru/product1/8002840332; HelpURL: https://static.chipdip.ru/lib/583/DOC001583059.pdf; Type: SMD

## Sheet PowerMonitor.SchDoc
size Letter; SheetNumber: 5; SheetTotal: 5
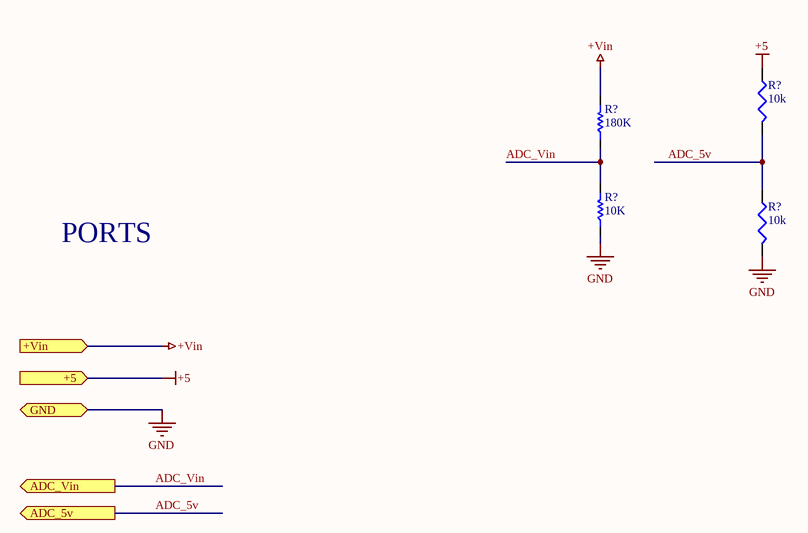
[diagram p6: PowerMonitor.SchDoc]

### Parts
(Parts that share a designator on the sheet are numbered #1, #2 ... from top to bottom, then left to right.)
R?#26  value 10k  [J1-0603]  (hidden comment: RC0603FR-0710KL)
R?#27  180K  [RES 0603 (1608X06L)]
R?#28  value 10k  [J1-0603]  (hidden comment: RC0603FR-0710KL)
R?#29  10K  [RES 0603 (1608X06L)]

### Ports
+5 (in), +Vin (in), ADC_5v (out), ADC_Vin (out), GND (bidir)

### Nets
+5: R?#26.1 ; port +5
+Vin: R?#27.2 ; port +Vin
GND: R?#28.2 R?#29.1 ; port GND
ADC_5v: R?#26.2 R?#28.1 ; port ADC_5v
ADC_Vin: R?#27.1 R?#29.2 ; port ADC_Vin

### Notes on the sheet
- PORTS

### Library data of the parts
R?#26 R?#28 = RC0603FR-0710KL: as R3 on sheet DCDC-LMR16030; ChipDip_Link: https://www.chipdip.ru/product0/9000079736; HelpURL: https://www.chipdip.ru/product0/9000079736; Package: R0603; Type: SMD; SnapEDA_Link: https://www.snapeda.com/parts/RC0603FR-0710KL/Yageo/view-part/?ref=dk&t=RC0603FR-0710KL&con_ref=None
R?#27 R?#29 = Resistor: Tolerance: 5%; Power: 1/8 W
  R?#27: Value: 180K
  R?#29: Value: 10K

## Nets that join several sheets
+1.2: ESP32_CAM (22 pins), CAN_TJA1042-SchoDoc (C?#10.1 U?#2.5)
+5: DCDC-LMR16030 (C5.2 C6.2 L1.1 R2.2), ESP32_CAM (Q?.3), CP2102_USB-UART (8 pins), CAN_TJA1042-SchoDoc (C?#9.1 CAN-AP?.1 U?#2.3), DCDC-LMR16030 (C5_DCDC-LMR16030.2 C6_DCDC-LMR16030.2 L1_DCDC-LMR16030.1 R2_DCDC-LMR16030.2), PowerMonitor (R?#26.1)
+Vin: DCDC-LMR16030 (C1.1 C2.1 U1.2), CAN_TJA1042-SchoDoc (CAN?.1 CAN?.2), DCDC-LMR16030 (C1_DCDC-LMR16030.1 C2_DCDC-LMR16030.1 U1_DCDC-LMR16030.2), PowerMonitor (R?#27.2)
GND: DCDC-LMR16030 (10 pins), ESP32_CAM (22 pins), DCDC-SPX3829m5 (5 pins), DCDC-SPX3829m5 (5 pins), DCDC-SPX3829m6 (5 pins), CP2102_USB-UART (20 pins), CAN_TJA1042-SchoDoc (11 pins), DCDC-LMR16030 (10 pins), PowerMonitor (R?#28.2 R?#29.1)
INPUT: DCDC-SPX3829m5 (5 pins), DCDC-SPX3829m5 (5 pins), DCDC-SPX3829m6 (5 pins)
OUTPUT: DCDC-SPX3829m5 (C?_DCDC-SPX3829m5#4.1 U?_DCDC-SPX3829m5#1.5), DCDC-SPX3829m5 (C?_DCDC-SPX3829m5#8.1 U?_DCDC-SPX3829m5#2.5), DCDC-SPX3829m6 (C?_DCDC-SPX3829m6#4.1 U?_DCDC-SPX3829m6.5)